# EAGLE design Top Screw (EAGLE 9.6.2)
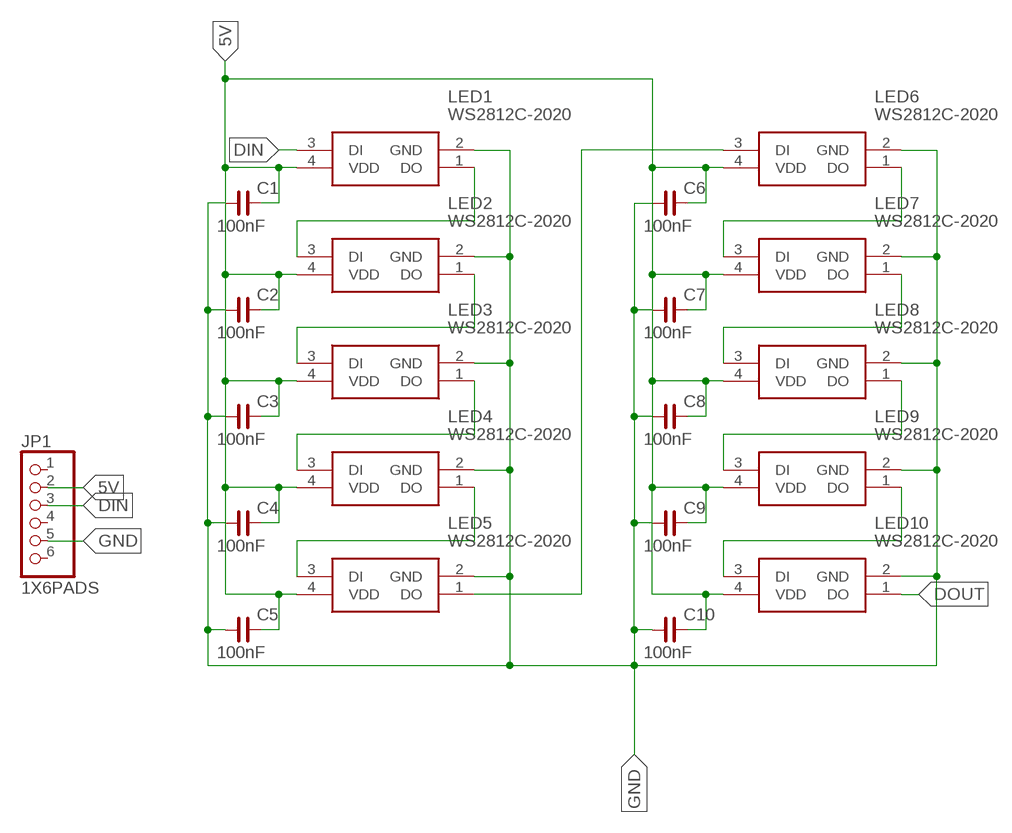
[diagram p0: schematic, sheet 1]

## Parts
C1  100nF  C_0402  [C0402]
C2  100nF  C_0402  [C0402]
C3  100nF  C_0402  [C0402]
C4  100nF  C_0402  [C0402]
C5  100nF  C_0402  [C0402]
C6  100nF  C_0402  [C0402]
C7  100nF  C_0402  [C0402]
C8  100nF  C_0402  [C0402]
C9  100nF  C_0402  [C0402]
C10  100nF  C_0402  [C0402]
JP1  1X6PADS  [1X6PADS]
LED1  WS2812C-2020  [WS2812C2020]
LED2  WS2812C-2020  [WS2812C2020]
LED3  WS2812C-2020  [WS2812C2020]
LED4  WS2812C-2020  [WS2812C2020]
LED5  WS2812C-2020  [WS2812C2020]
LED6  WS2812C-2020  [WS2812C2020]
LED7  WS2812C-2020  [WS2812C2020]
LED8  WS2812C-2020  [WS2812C2020]
LED9  WS2812C-2020  [WS2812C2020]
LED10  WS2812C-2020  [WS2812C2020]

## Nets
5V: C1.2 C2.2 C3.2 C4.2 C5.2 C6.2 C7.2 C8.2 C9.2 C10.2 JP1.2 LED1.4(VDD) LED2.4(VDD) LED3.4(VDD) LED4.4(VDD) LED5.4(VDD) LED6.4(VDD) LED7.4(VDD) LED8.4(VDD) LED9.4(VDD) LED10.4(VDD)
DIN: JP1.3 LED1.3(DI)
DOUT: LED10.1(DO)
GND: C1.1 C2.1 C3.1 C4.1 C5.1 C6.1 C7.1 C8.1 C9.1 C10.1 JP1.5 LED1.2(GND) LED2.2(GND) LED3.2(GND) LED4.2(GND) LED5.2(GND) LED6.2(GND) LED7.2(GND) LED8.2(GND) LED9.2(GND) LED10.2(GND)
N$1: LED1.1(DO) LED2.3(DI)
N$2: LED2.1(DO) LED3.3(DI)
N$3: LED3.1(DO) LED4.3(DI)
N$4: LED4.1(DO) LED5.3(DI)
N$5: LED5.1(DO) LED6.3(DI)
N$6: LED6.1(DO) LED7.3(DI)
N$7: LED7.1(DO) LED8.3(DI)
N$8: LED8.1(DO) LED9.3(DI)
N$9: LED9.1(DO) LED10.3(DI)
Unconnected: JP1.1 JP1.4 JP1.6

## Library data of the parts
C1-C10 = rc-master-smd:C_: NON-POLARIZED CAP
JP1 = SMD Pads:1X6PADS
LED1-LED10 = WS2812C-2020:WS2812C-2020: Intelligent control LED integrated light source Source: Datasheet <http://www.world-semi.com/DownLoadFile/139>; ARROW_PART_NUMBER: WS2812C-2020; DESCRIPTION: Intelligent control LED integrated light source; HEIGHT: 0.84mm; MANUFACTURER_NAME: Worldsemi; MANUFACTURER_PART_NUMBER: WS2812C-2020

## Board
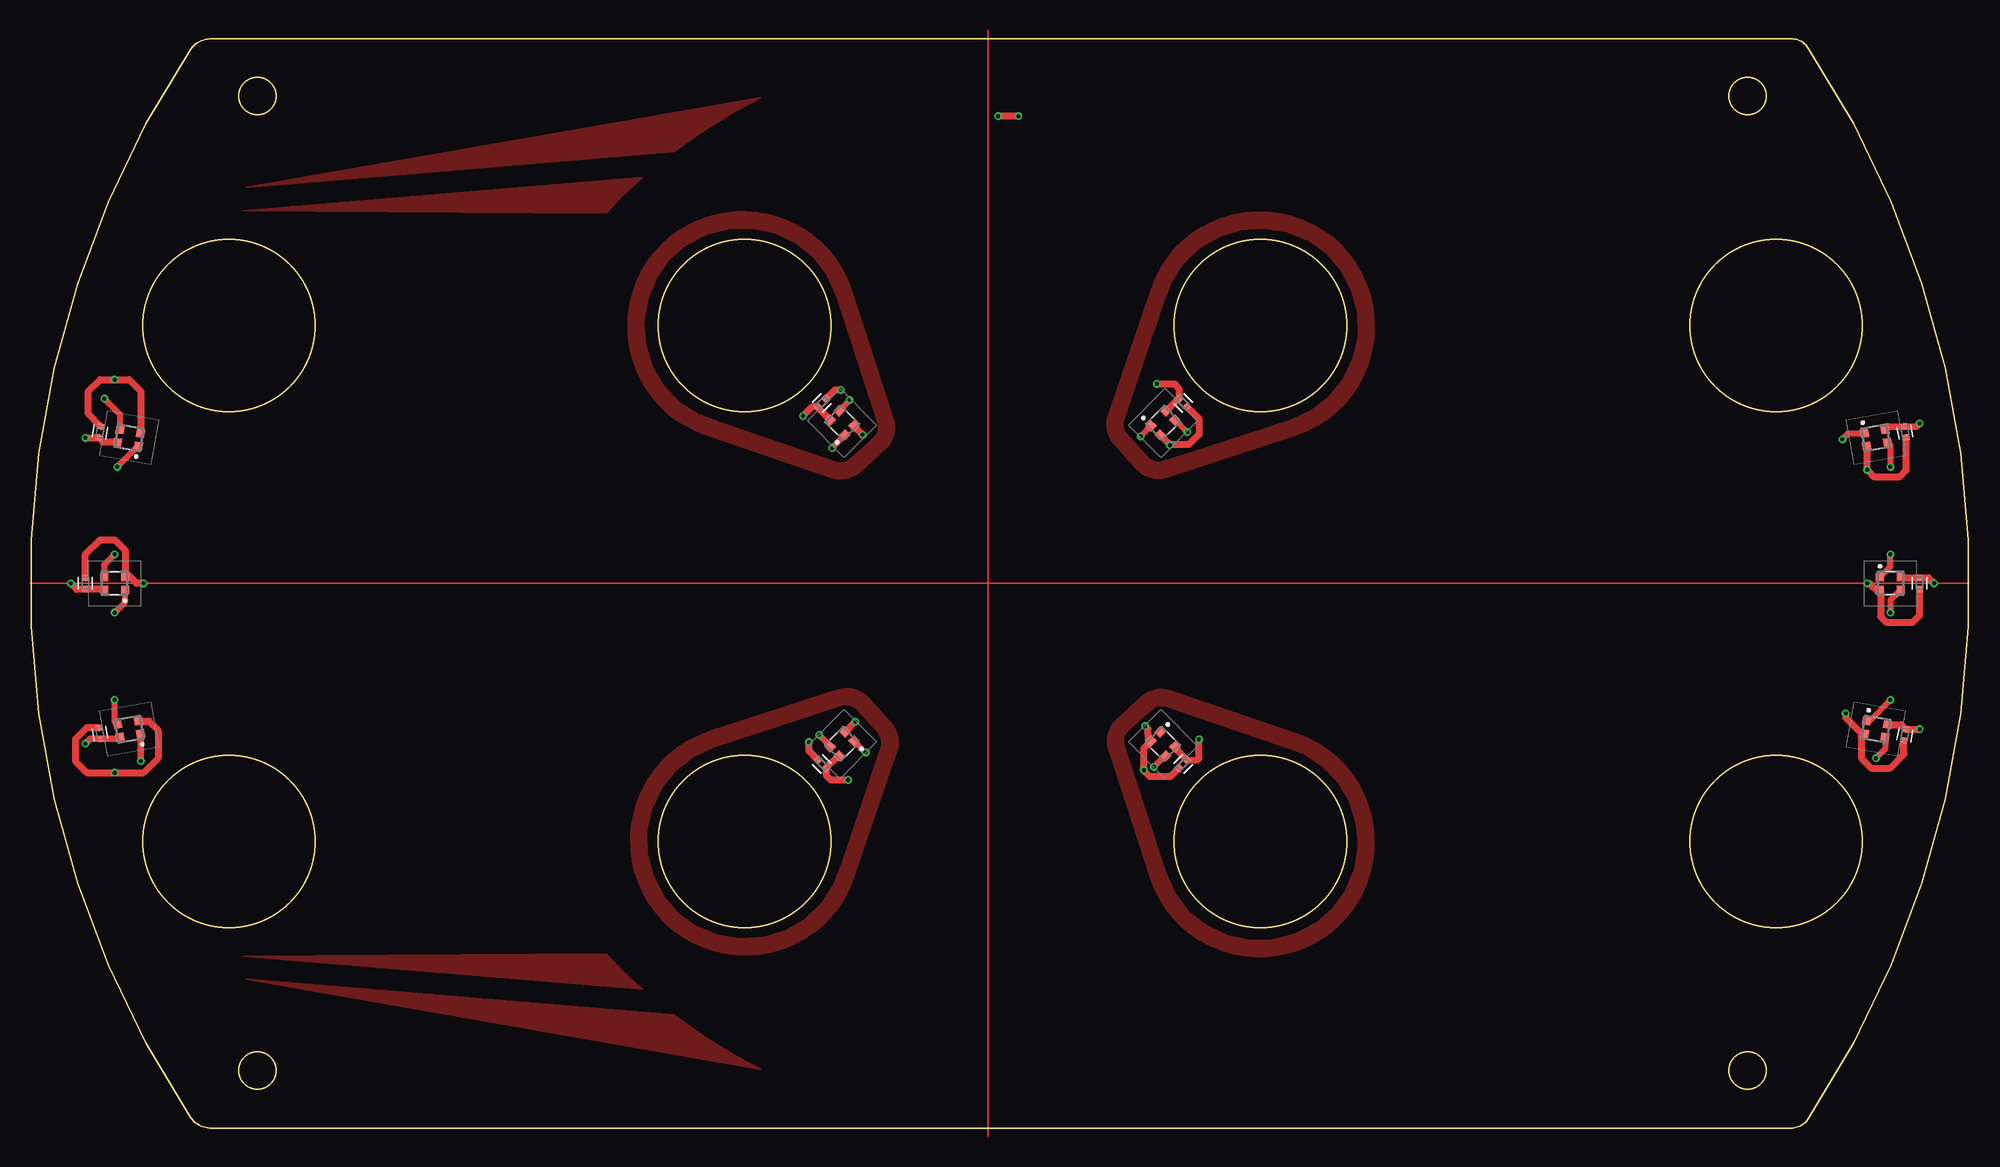
[diagram p1: board, top side]
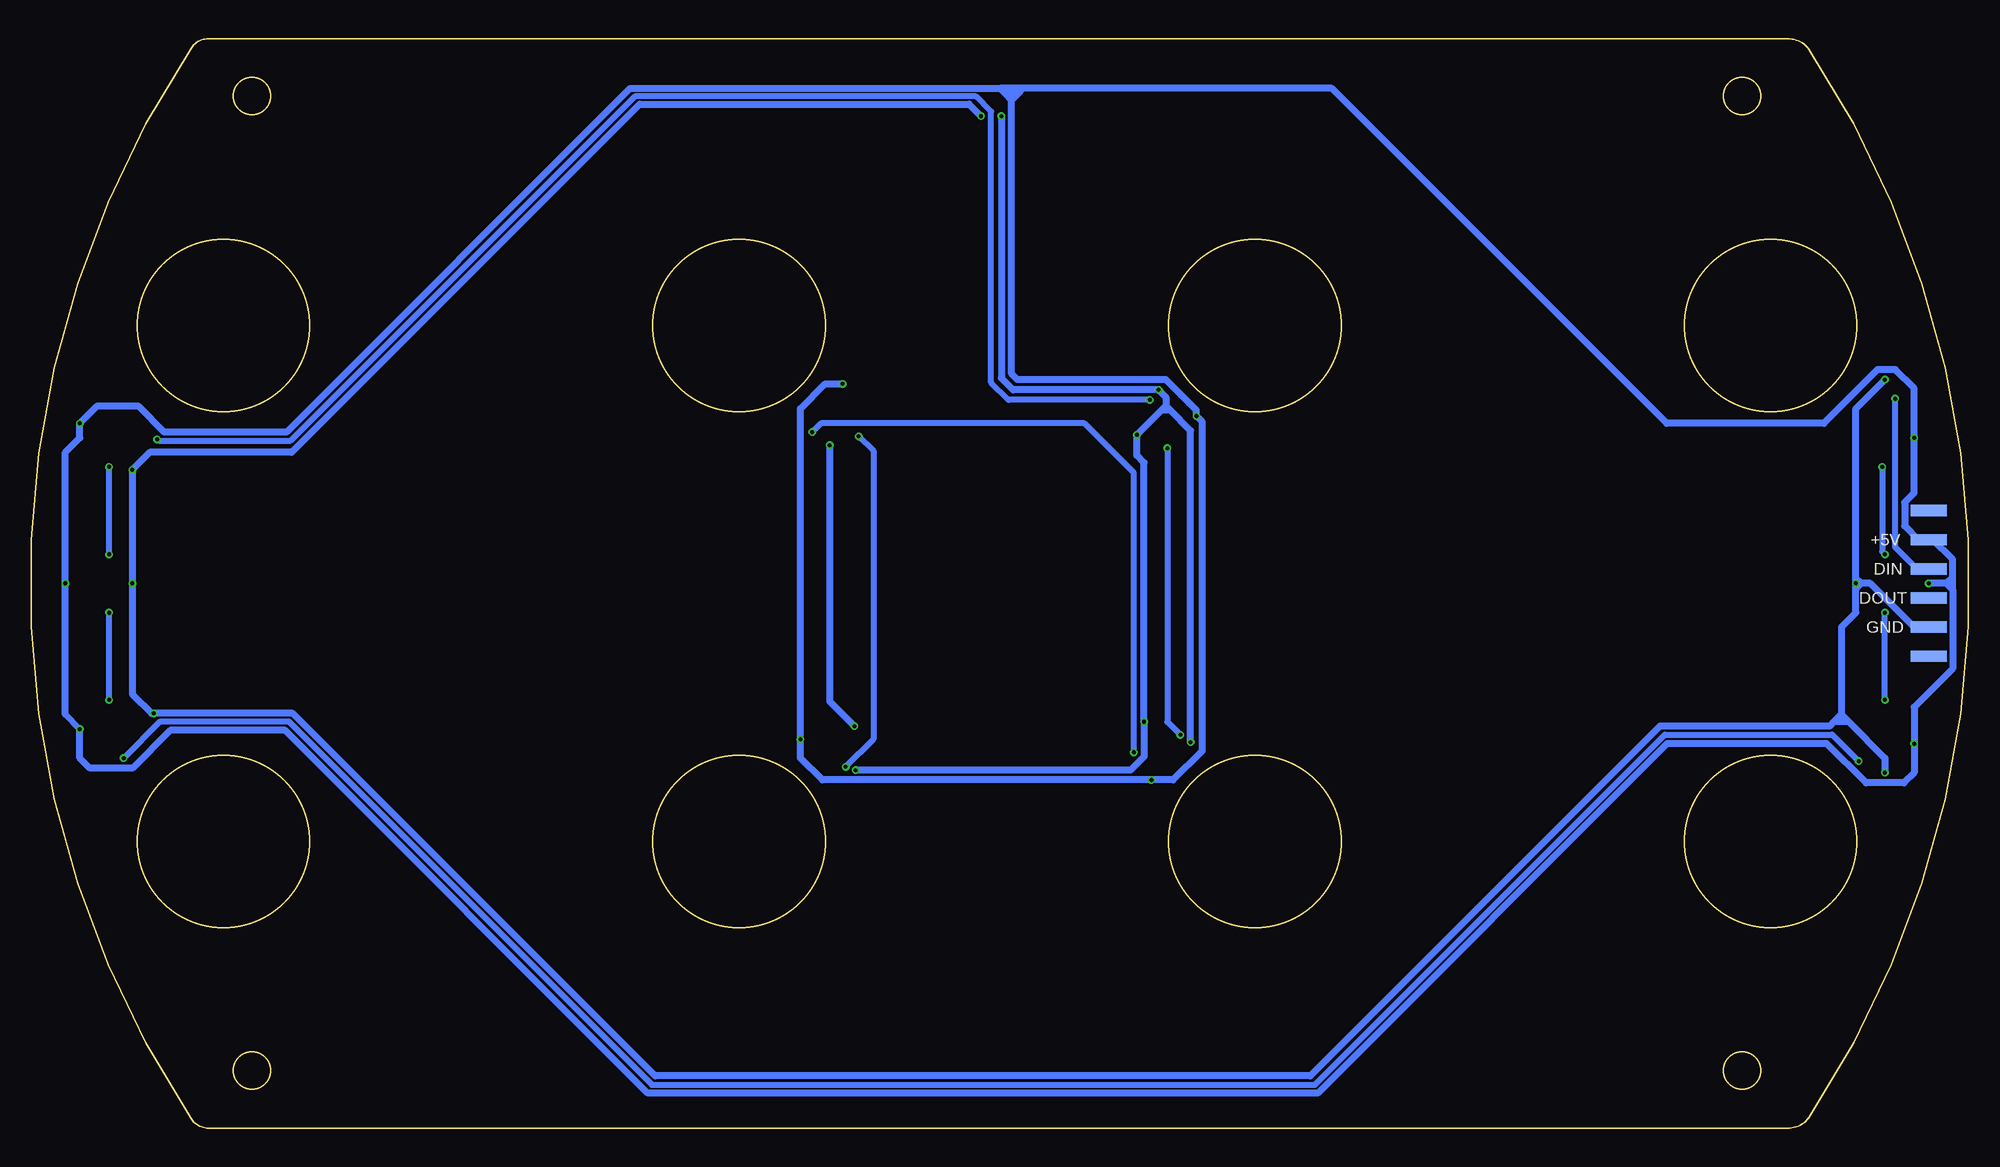
[diagram p2: board, bottom side, seen from below]

Size 169.02 x 95 mm. Coordinates in mm from the lower left corner, seen from the top.
Outline: 15.82,95 153.68,95 arc-57 155.11,94.11 arc-67 155.11,0.9 arc-57 153.68,0 15.82,0 arc-57 13.91,0.9 arc-67 13.91,94.11 arc-57 15.82,95
Outline: circle at 149.75,90 radius 1.6
Outline: circle at 107.25,70 radius 7.5
Outline: circle at 17.25,25 radius 7.5
Outline: circle at 152.25,70 radius 7.5
Outline: circle at 19.75,5 radius 1.6
Outline: circle at 17.25,70 radius 7.5
Outline: circle at 62.25,25 radius 7.5
Outline: circle at 107.25,25 radius 7.5
Outline: circle at 149.75,5 radius 1.6
Outline: circle at 152.25,25 radius 7.5
Outline: circle at 19.75,90 radius 1.6
Outline: circle at 62.25,70 radius 7.5
Copper layers (1*16): Top 0.035mm / dielectric 1.5mm / Bottom 0.035mm
Design rules "default *": minimum track width 5mil, minimum drill 0.3mm, track to track 5mil, track to pad 0.229mm, pad to pad 0.229mm, via to via 0.229mm, smd to smd 5mil, copper to edge 0.5mm, drill to drill 0.5mm, minimum pad ring 0.15mm, minimum via ring 0.15mm, stop-mask expansion 4mil, vias tented up to drill 0.35mm, thermal gap 10mil

### Footprints (pad centres in the part's own frame; a part is rotated, then mirrored left to right if it is on the bottom)
CAPC1005X55N = smd 0.527 x 0.6: 1 -0.486,0; 2 0.486,0
1X6PADS = smd 3.135 x 1: 1 0,6.35; 2 0,3.81; 3 0,1.27; 4 0,-1.27; 5 0,-3.81; 6 0,-6.35
WS2812C2020 = smd 0.7 x 0.7: 1 0.915,-0.55; 2 0.915,0.55; 3 -0.915,0.55; 4 -0.915,-0.55

### Placement (x,y rotation side)
C1  100nF  [CAPC1005X55N]  6.01,60.71 260 top
C2  100nF  [CAPC1005X55N]  4.74,47.5 270 top
C3  100nF  [CAPC1005X55N]  6.01,34.42 280 top
C4  100nF  [CAPC1005X55N]  163.49,34.29 80 top
C5  100nF  [CAPC1005X55N]  164.76,47.5 90 top
C6  100nF  [CAPC1005X55N]  163.49,60.71 100 top
C7  100nF  [CAPC1005X55N]  69,63.25 225 top
C8  100nF  [CAPC1005X55N]  69,31.75 315 top
C9  100nF  [CAPC1005X55N]  100.5,63.25 135 top
C10  100nF  [CAPC1005X55N]  100.5,31.75 45 top
JP1  3.47,47.5 0 bottom
LED1  8.55,60.2 350 top
LED2  7.28,47.5 0 top
LED3  8.55,34.8 10 top
LED4  160.95,34.8 170 top
LED5  162.22,47.5 180 top
LED6  160.95,60.2 190 top
LED7  70.75,61.5 315 top
LED8  70.75,33.5 45 top
LED9  98.75,61.5 225 top
LED10  98.75,33.5 135 top

### Tracks (layer width: path | path; a pad name or v marks a point on that pad's centre or on a via)
5V  (via drill 0.35)
  Top 0.508: LED2.4 6.32,46.99
  Top 0.559: LED5.4 163.17,48.01
  Top 0.61: LED7.4 68.64,62.83 C7.2 68.13,62.89 v67.35,62.11 | LED8.4 70.43,32.47 C8.2 69.36,30.76 69.76,30.36 v71.29,30.36 | LED10.4 99.78,33.18 C10.2 101.74,32.11 101.89,32.26 v101.89,33.91 | LED9.4 100.08,63.61 C9.2 100.14,64.5 99.73,64.9 v98.21,64.9 | LED6.4 162.06,61.21 C6.2 164.5,61.21 v164.76,61.47 | 163.17,48.01 C5.2 165.52,48.01 v166.03,47.5 | LED4.4 163.19,35.18 C4.2 v164.75,34.79 v164.76,34.8 | 6.32,46.99 C2.2 3.98,46.99 v3.47,47.5 | LED1.4 6.31,59.82 C1.2 v4.75,60.21 v4.74,60.2 | LED3.4 7.56,33.92 C3.2 5.13,33.92 v4.74,33.53
  Bottom 0.508: 4.36,51.31 JP1.2
  Bottom 0.559: v164.76,34.8 166.03,36.07
  Bottom 0.61: v98.21,64.9 99.73,64.9 101.89,62.74 v101.89,33.91 101.89,32.26 99.99,30.36 v71.29,30.36 69.38,30.36 66.84,32.9 66.84,61.6 v67.35,62.11 67.35,62.61 70.02,65.28 82.97,65.28 83.48,65.79 83.48,89.67 | 82.46,90.68 55.54,90.68 26.33,61.47 12.61,61.47 7.94,66.14 6.36,66.14 4.74,64.52 v4.74,60.2 4.74,55.4 5.57,54.57 5.57,52.52 4.36,51.31 | 82.46,90.68 84.49,90.68 | 84.49,90.68 116.75,90.68 146.72,60.71 157.39,60.71 159.68,63 163.23,63 v164.76,61.47 164.76,60.2 166.03,58.93 v166.03,47.5 166.03,36.07 | v164.76,34.8 164.76,32.26 163.9,31.4 160.16,31.4 156.88,34.67 146.85,34.67 115.23,3.05 56.77,3.05 26.29,33.53 12.36,33.53 8.93,30.1 5.63,30.1 4.74,30.99 v4.74,33.53 4.74,36.71 1.37,40.08 1.37,46.95 1.42,47.01 | 1.37,48.05 1.37,49.59 3.09,51.31 JP1.2 | 1.42,47.01 1.92,47.5 | 1.92,47.5 v3.47,47.5 | 1.37,48.05 1.92,47.5 | 1.42,47.01 1.37,47.06 1.37,48.05 | 83.48,89.67 83.99,90.17 | 83.99,90.17 84.49,90.68 | 82.46,90.68 82.97,90.17 | 82.97,90.17 83.48,89.67 | 82.97,90.17 83.99,90.17
DIN  (via drill 0.35)
  Top 0.508: v6.39,63.63 7.74,62.28 LED1.3
  Bottom 0.508: JP1.3 4.48,48.77 6.39,50.68 v6.39,63.63
GND  (via drill 0.35)
  Top 0.559: 160.19,59.46 LED6.2 | LED5.2 161.3,46.61
  Top 0.61: 160.19,59.46 v160.19,57.41 160.82,56.77 162.98,56.77 163.58,57.37 C6.1 | v160.19,47.5 160.4,47.5 160.73,47.17 160.75,47.17 161.3,46.61 161.36,46.56 161.36,44.61 161.86,44.1 164.15,44.1 164.76,44.71 C5.1 | C7.1 70.14,64.39 v70.65,64.39 | v72.56,60.46 71.78,61.23 LED7.2 | LED8.2 71.9,35.44 v71.92,35.44 | 97.47,33.51 97.08,33.12 v97.08,31.22 97.1,31.2 97.1,31.14 97.6,30.64 99.39,30.64 C10.1 | 97.47,33.51 LED10.2 | C8.1 67.86,32.89 v67.86,33.66 | LED9.2 99.35,59.6 | 99.35,59.6 v99.35,59.57 | C9.1 101.89,61.86 101.89,60.51 100.98,59.6 99.35,59.6 | 97.47,33.51 97.47,34.31 97.46,34.32 97.46,34.79 v97.19,35.06 | C2.1 4.74,50.04 6.01,51.31 7.28,51.31 8.19,50.4 8.19,48.52 | 8.19,48.52 LED2.2 | v9.82,47.5 9.21,47.5 8.19,48.52 | C1.1 4.99,62.31 4.99,64.27 6.01,65.28 v7.28,65.28 8.55,65.28 9.54,64.28 LED1.2 | LED3.2 10.26,35.5 11.09,34.67 11.09,32.26 9.82,30.99 v7.28,30.99 4.86,30.99 3.85,32.01 3.85,33.91 4.86,34.92 C3.1 | v158.31,36.17 158.31,35.79 159.68,34.42 | LED4.2 159.68,34.42 | 159.68,34.42 159.68,32.26 160.54,31.4 162.19,31.4 163.4,32.61 C4.1 | v86.14,88.27 v84.37,88.27
  Bottom 0.559: v9.82,47.5 9.82,48.01 9.31,47.5 | v9.82,47.5 9.82,46.99 9.31,47.5 | v9.82,47.5 9.31,47.5
  Bottom 0.61: 70.02,63 70.4,62.61 | 70.4,62.61 v72.56,60.46 72.56,58.68 71.92,58.04 v71.92,35.44 71.92,32.39 73.09,31.22 v97.08,31.22 | 70.02,63 70.02,63.76 v70.65,64.39 83.35,64.39 84.37,65.41 v84.37,88.27 | v67.86,33.66 67.86,60.84 69.63,62.61 | 69.63,62.61 70.02,63 | 69.63,62.61 70.4,62.61 | v99.35,59.57 99.35,37.21 v97.19,35.06 | v86.14,88.27 87.19,89.31 115.93,89.31 146.31,58.93 158.66,58.93 v160.19,57.41 v160.19,47.5 160.19,37.85 158.51,36.17 v158.31,36.17 146.19,36.17 114.57,4.55 57.42,4.55 26.92,35.06 12.1,35.06 11.72,35.44 | JP1.5 4.74,43.69 8.55,47.5 9.31,47.5 | v7.28,65.28 9.82,62.74 9.82,46.99 9.82,44.96 11.09,43.69 11.09,36.07 | 11.09,36.07 10.45,35.44 | 10.45,35.44 7.28,32.26 v7.28,30.99 | 11.09,36.07 11.72,35.44 | 10.45,35.44 11.72,35.44
N$1  (via drill 0.35)
  Top 0.508: LED1.1 7.53,57.68 v7.53,57.66 | v7.28,50.04 6.36,49.13 LED2.3
  Bottom 0.508: v7.53,57.66 7.53,50.3 v7.28,50.04
N$2  (via drill 0.35)
  Top 0.508: LED3.3 7.28,35.46 v7.28,37.34 | v7.28,44.96 8.19,45.88 LED2.1
  Bottom 0.508: v7.28,37.34 v7.28,44.96
N$3  (via drill 0.35)
  Top 0.508: LED4.3 161.75,33.07 v160.95,32.26
  Top 0.559: LED3.1 9.54,32.03 v9.56,32.01
  Bottom 0.508: v160.95,32.26 157.75,35.46 146.54,35.46 114.84,3.77 57.03,3.77 26.47,34.32 11.87,34.32 v9.56,32.01
N$4  (via drill 0.35)
  Top 0.508: LED5.3 162.22,46.04 v162.22,44.96 | LED4.1 160.38,35.5 v162.22,37.34
  Bottom 0.508: v162.22,37.34 v162.22,44.96
N$5  (via drill 0.35)
  Top 0.508: LED5.1 162.22,48.97 v162.22,50.04 | LED6.3 162.22,59.55 v162.22,57.66
  Bottom 0.508: v162.22,50.04 v162.22,57.66
N$6  (via drill 0.35)
  Top 0.508: LED7.3 71.41,63.46 v71.41,63.5 | v158.03,60.07 158.54,60.58 LED6.1
  Bottom 0.508: v71.41,63.5 83.73,63.5 85.26,65.03 85.26,88.65 86.6,90 116.34,90 146.39,59.95 157.9,59.95 v158.03,60.07
N$7  (via drill 0.35)
  Top 0.508: LED7.1 69.89,59.35 v69.89,59.31 | v68.75,34.29 69.71,33.33 LED8.3
  Bottom 0.508: v69.89,59.31 69.89,35.44 v68.75,34.29
N$8  (via drill 0.35)
  Top 0.508: LED8.1 72.77,32.77 v72.81,32.77 | v100.88,60.71 100.83,60.71 LED9.3
  Bottom 0.508: v72.81,32.77 72.81,57.15 77.13,61.47 100.11,61.47 v100.88,60.71
N$9  (via drill 0.35)
  Top 0.508: LED9.1 96.81,60.34 v96.81,60.33 | v97.96,31.5 98.92,32.47 LED10.3
  Bottom 0.508: v96.81,60.33 95.54,59.06 95.54,33.91 v97.96,31.5
S$1
  pour Top: 71.58,73.04 arc233 58.85,60.48 69.84,56.74 arc61 72.32,57.26 74.52,59.25 arc66 75.21,61.87
S$2
  cutout Top: 53.9,72.25 53.58,70.27 53.72,68.33 54.3,66.5 55.32,64.79 56.72,63.35 58.38,62.29 60.19,61.61 69.53,58.43 70.46,58.12 70.95,58.17 71.37,58.42 72.83,59.74 73.55,60.41 73.79,60.83 73.81,61.32 72.59,65.07 70.15,72.57 69.34,74.33 68.12,75.91 66.56,77.16 64.79,78 62.91,78.4 60.94,78.37 59,77.86 57.24,76.94 55.79,75.67 54.65,74.1
S$36
  pour Top: 63.75,89.91 18.5,82 56.06,85.14 arc-11
S$40
  pour Top: 53.35,82.91 18.5,80 50.16,79.8 arc-11
S$43
  pour Top: 63.75,5.09 18.5,13 56.06,9.86 arc11
S$47
  pour Top: 50.16,15.2 18.5,15 53.35,12.09 arc-11
S$49
  pour Top: 110.28,60.42 arc233 97.72,73.15 93.99,62.16 arc61 94.5,59.67 96.5,57.48 arc66 99.12,56.78
S$50
  cutout Top: 109.49,78.1 107.52,78.41 105.58,78.27 103.74,77.69 102.04,76.68 100.6,75.28 99.54,73.62 98.85,71.8 95.67,62.47 95.37,61.53 95.41,61.04 95.66,60.63 96.99,59.17 97.65,58.44 98.08,58.21 98.57,58.19 102.32,59.4 109.82,61.84 111.58,62.65 113.15,63.87 114.41,65.43 115.25,67.21 115.65,69.08 115.62,71.05 115.11,73 114.18,74.75 112.92,76.21 111.34,77.34
S$51
  pour Top: 59.21,34.59 arc233 71.77,21.86 75.51,32.84 arc61 74.99,35.33 73,37.52 arc66 70.38,38.22
S$52
  cutout Top: 60,16.9 61.98,16.59 63.92,16.73 65.75,17.31 67.46,18.33 68.9,19.72 69.96,21.39 70.64,23.2 73.82,32.54 74.12,33.47 74.08,33.96 73.83,34.38 72.51,35.84 71.84,36.56 71.42,36.8 70.93,36.82 67.18,35.6 59.67,33.16 57.92,32.35 56.34,31.13 55.09,29.57 54.25,27.79 53.85,25.92 53.88,23.95 54.38,22.01 55.31,20.25 56.58,18.8 58.15,17.66
S$53
  pour Top: 97.66,21.84 arc233 110.39,34.4 99.41,38.14 arc61 96.92,37.62 94.73,35.63 arc66 94.03,33
S$54
  cutout Top: 115.34,22.63 115.66,24.61 115.52,26.55 114.94,28.38 113.92,30.08 112.52,31.52 110.86,32.59 109.05,33.27 99.71,36.45 98.78,36.75 98.29,36.71 97.87,36.46 96.41,35.13 95.69,34.47 95.45,34.04 95.43,33.55 96.65,29.8 99.09,22.3 99.9,20.55 101.12,18.97 102.68,17.71 104.46,16.88 106.33,16.47 108.3,16.51 110.24,17.01 112,17.94 113.45,19.2 114.59,20.78
(copper drawn outside any net)
  shapes: Top area x3

### Text on the board
bPlace: +5V | DIN | DOUT | GND